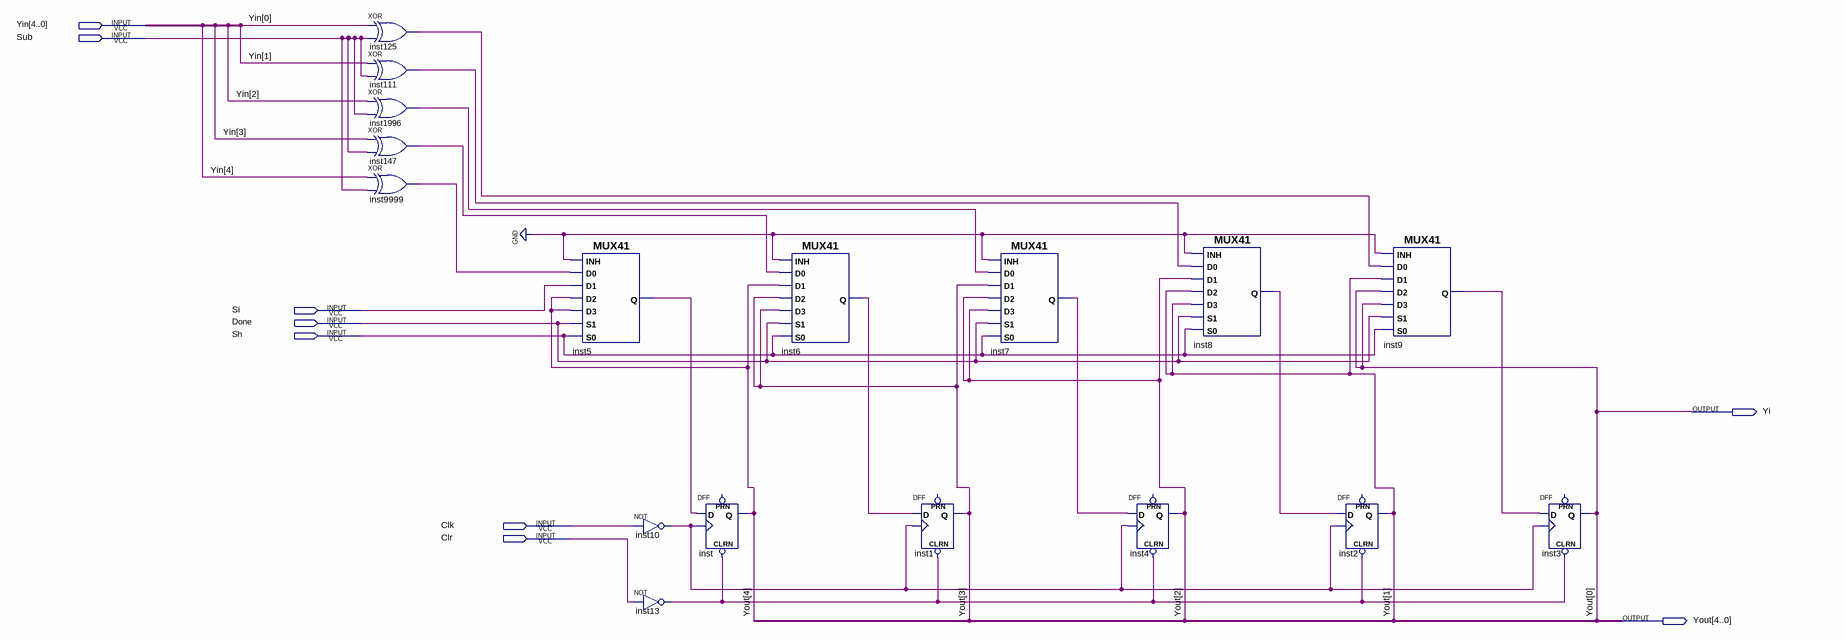
[diagram p0: schematic sheet]
// Quartus schematic Y_Accumulator.bdf as structural Verilog: 17 symbols, 9 pins
module Y_Accumulator (
  input  [4:0] Yin,
  input  Sub,
  input  Si,
  input  Done,
  input  Sh,
  input  Clk,
  input  Clr,
  output Yi,
  output [4:0] Yout
);

  wire inst5_q, inst6_q, inst7_q, inst8_q, inst9_q, inst10_out, inst13_out, inst111_out, inst125_out,
       inst147_out, inst1996_out, inst9999_out;

  xor inst125 (inst125_out, Yin[0], Sub);
  xor inst111 (inst111_out, Yin[1], Sub);
  xor inst1996 (inst1996_out, Yin[2], Sub);
  xor inst147 (inst147_out, Yin[3], Sub);
  xor inst9999 (inst9999_out, Yin[4], Sub);
  MUX41 inst5 (.S0(Sh), .D2(Yout[4]), .S1(Done), .D3(Yout[4]), .D0(inst9999_out), .INH(1'b0), .D1(Si), .Q(inst5_q));
  not inst10 (inst10_out, Clk);
  not inst13 (inst13_out, Clr);
  DFF inst (.CLRN(inst13_out), .CLK(inst10_out), .D(inst5_q), .Q(Yout[4]));  // open: PRN
  MUX41 inst6 (.S0(Sh), .D2(Yout[3]), .S1(Done), .D3(Yout[3]), .D0(inst147_out), .INH(1'b0), .D1(Yout[4]), .Q(inst6_q));
  DFF inst1 (.CLRN(inst13_out), .CLK(inst10_out), .D(inst6_q), .Q(Yout[3]));  // open: PRN
  MUX41 inst7 (
    .S0(Sh), .D2(Yout[2]), .S1(Done), .D3(Yout[2]), .D0(inst1996_out), .INH(1'b0), .D1(Yout[3]), .Q(inst7_q));
  DFF inst4 (.CLRN(inst13_out), .CLK(inst10_out), .D(inst7_q), .Q(Yout[2]));  // open: PRN
  MUX41 inst8 (.S0(Sh), .D2(Yout[1]), .S1(Done), .D3(Yout[1]), .D0(inst111_out), .INH(1'b0), .D1(Yout[2]), .Q(inst8_q));
  MUX41 inst9 (.S0(Sh), .D2(Yi), .S1(Done), .D3(Yi), .D0(inst125_out), .INH(1'b0), .D1(Yout[1]), .Q(inst9_q));
  DFF inst2 (.CLRN(inst13_out), .CLK(inst10_out), .D(inst8_q), .Q(Yout[1]));  // open: PRN
  DFF inst3 (.CLRN(inst13_out), .CLK(inst10_out), .D(inst9_q), .Q(Yi));  // open: PRN

  assign Yout[0] = Yi;
endmodule
